# Altium schematic sheet CON_PCIe_X4.SchDoc
size A4
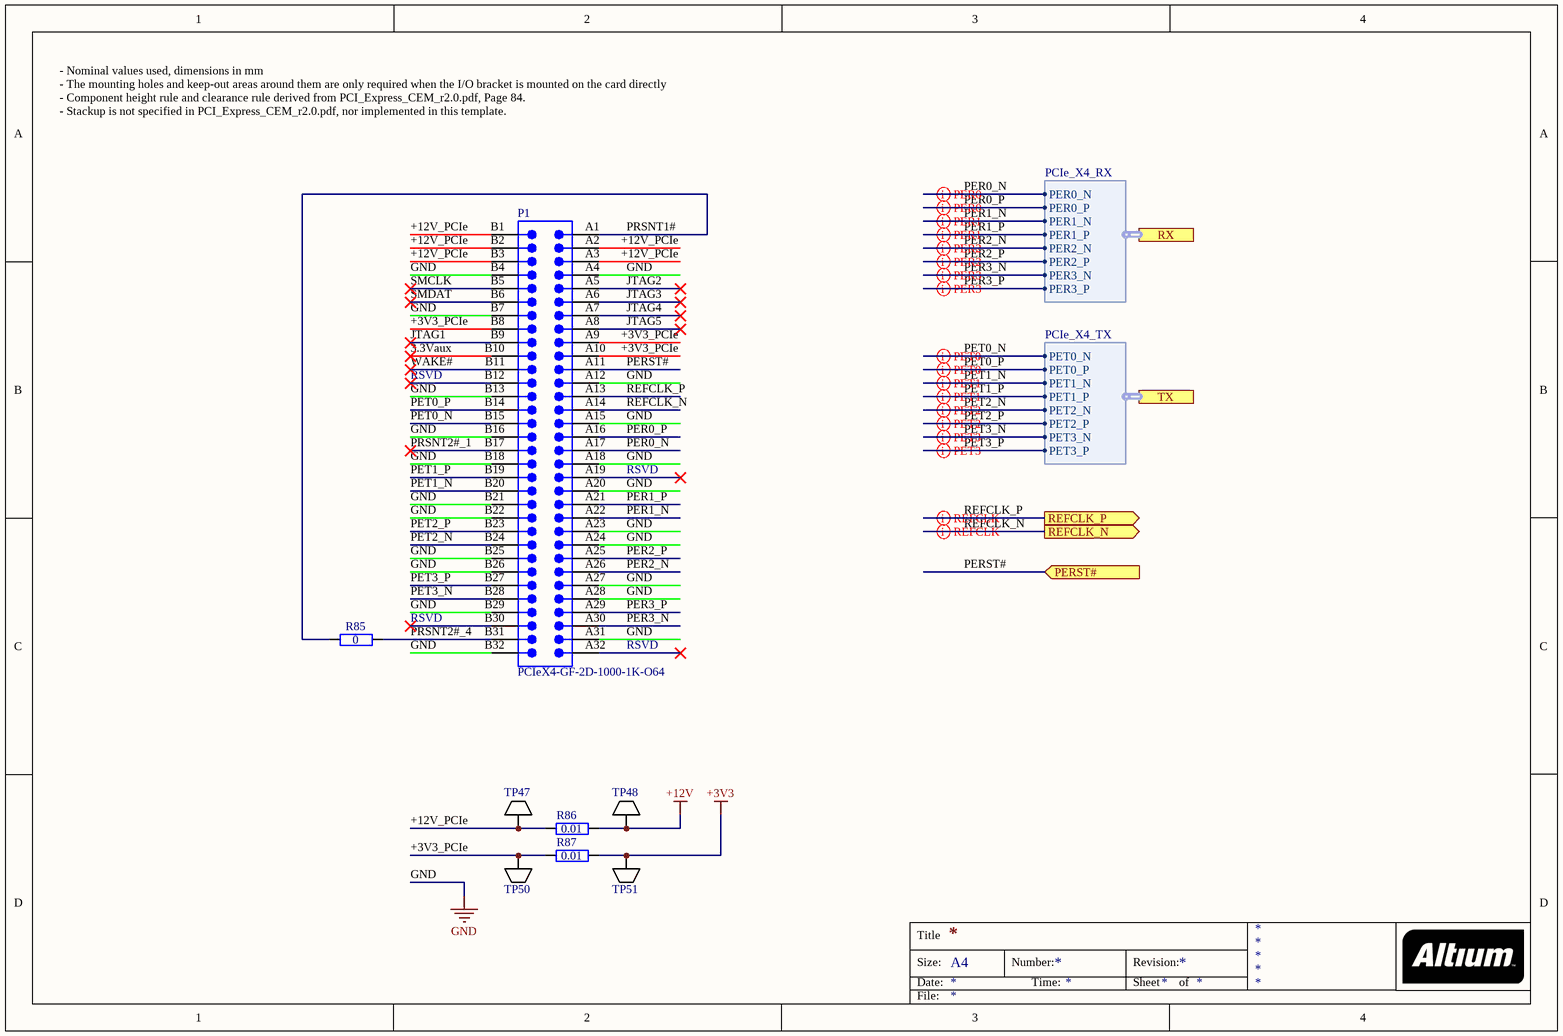
[diagram p0: CON_PCIe_X4.SchDoc]

## Parts
P1  PCIeX4-GF-2D-1000-1K-O64  [PCIeX4-GF-2D-1000-1K-O64]  (no BOM)
R85  0  [GEN_R_0402]
R86  0.01  [GEN_R_0603]
R87  0.01  [GEN_R_0603]
TP47  5015  [KEY_5015]  (value not drawn)
TP48  5015  [KEY_5015]  (value not drawn)
TP50  5015  [KEY_5015]  (value not drawn)
TP51  5015  [KEY_5015]  (value not drawn)

## Ports
PERST# (in), REFCLK_N (out), REFCLK_P (out), RX (harness PCIe_X4_RX), TX (harness PCIe_X4_TX)

## Harnesses
PCIe_X4_RX: PER0_N, PER0_P, PER1_N, PER1_P, PER2_N, PER2_P, PER3_N, PER3_P
PCIe_X4_TX: PET0_N, PET0_P, PET1_N, PET1_P, PET2_N, PET2_P, PET3_N, PET3_P

## Nets
+3V3: R87.2 TP51.1
+12V: R86.2 TP48.1
GND: P1.A4 P1.A12 P1.A15 P1.A18 P1.A20 P1.A23 P1.A24 P1.A27 P1.A28 P1.A31 P1.B4 P1.B7 P1.B13 P1.B16 P1.B18 P1.B21 P1.B22 P1.B25 P1.B26 P1.B29 P1.B32
3.3Vaux: P1.B10
+3V3_PCIe: P1.A9 P1.A10 P1.B8 R87.1 TP50.1
+12V_PCIe: P1.A2 P1.A3 P1.B1 P1.B2 P1.B3 R86.1 TP47.1
JTAG1: P1.B9
JTAG2: P1.A5
JTAG3: P1.A6
JTAG4: P1.A7
JTAG5: P1.A8
PER0_N: P1.A17 ; port RX.PER0_N
PER0_P: P1.A16 ; port RX.PER0_P
PER1_N: P1.A22 ; port RX.PER1_N
PER1_P: P1.A21 ; port RX.PER1_P
PER2_N: P1.A26 ; port RX.PER2_N
PER2_P: P1.A25 ; port RX.PER2_P
PER3_N: P1.A30 ; port RX.PER3_N
PER3_P: P1.A29 ; port RX.PER3_P
PERST#: P1.A11 ; port PERST#
PET0_N: P1.B15 ; port TX.PET0_N
PET0_P: P1.B14 ; port TX.PET0_P
PET1_N: P1.B20 ; port TX.PET1_N
PET1_P: P1.B19 ; port TX.PET1_P
PET2_N: P1.B24 ; port TX.PET2_N
PET2_P: P1.B23 ; port TX.PET2_P
PET3_N: P1.B28 ; port TX.PET3_N
PET3_P: P1.B27 ; port TX.PET3_P
PRSNT1#: P1.A1 R85.1
PRSNT2#_1: P1.B17
PRSNT2#_4: P1.B31 R85.2
REFCLK_N: P1.A14 ; port REFCLK_N
REFCLK_P: P1.A13 ; port REFCLK_P
SMCLK: P1.B5
SMDAT: P1.B6
WAKE#: P1.B11

Not connected (* = marked no-connect by the designer): P1 A19* A32* B12* B30*

## Layout directives
differential pair: PER0_N, PER0_P, PER1_N, PER1_P, PER2_N, PER2_P, PER3_N, PER3_P, PET0_N, PET0_P, PET1_N, PET1_P, PET2_N, PET2_P, PET3_N, PET3_P, REFCLK_N, REFCLK_P

## Notes on the sheet
- - Nominal values used, dimensions in mm
  - The mounting holes and keep-out areas around them are only required when the I/O bracket is mounted on the card directly
  - Component height rule and clearance rule derived from PCI_Express_CEM_r2.0.pdf, Page 84.
  - Stackup is not specified in PCI_Express_CEM_r2.0.pdf, nor implemented in this template.
- RSVD
- (near R85) RSVD
- Title
- Size:
- Date:
- A4
- Number:
- Time:
- Revision:
- Sheet
- of
- File:

## Library data of the parts
P1 = CMP-0001-00031-2: Golden finger, PCIeX4, Dual, Opposite, Pitch 1mm, 64-Position; Mating Connector: Molex-87715-9106; Datasheet Version: rev2.0, Apr-2007; Package Reference: PCIeX4-GF-2D-1000-1K-O64; ClassName: Edge Connector; Publisher: Altium
R85 = RES 0 OHM 1/16W 0402: Power Rating: 0.0625W; Package: 0402; Supplier 1: Digi-Key; Supplier Part Number 1: 311-0.0JRCT-ND; Value: 0
R86 R87 = RES 0.01 OHM 1% 1/4W 0603: Tolerance: 1%; Power Rating: 0.25W; Supplier 1: Digi-Key; Supplier Part Number 1: 408-1404-1-ND; Value: 0.01; Package: 0603
TP47 TP48 TP50 TP51 = TP KEYSTONE 5015: Supplier 1: Digi-Key; Supplier Part Number 1: 36-5015CT-ND